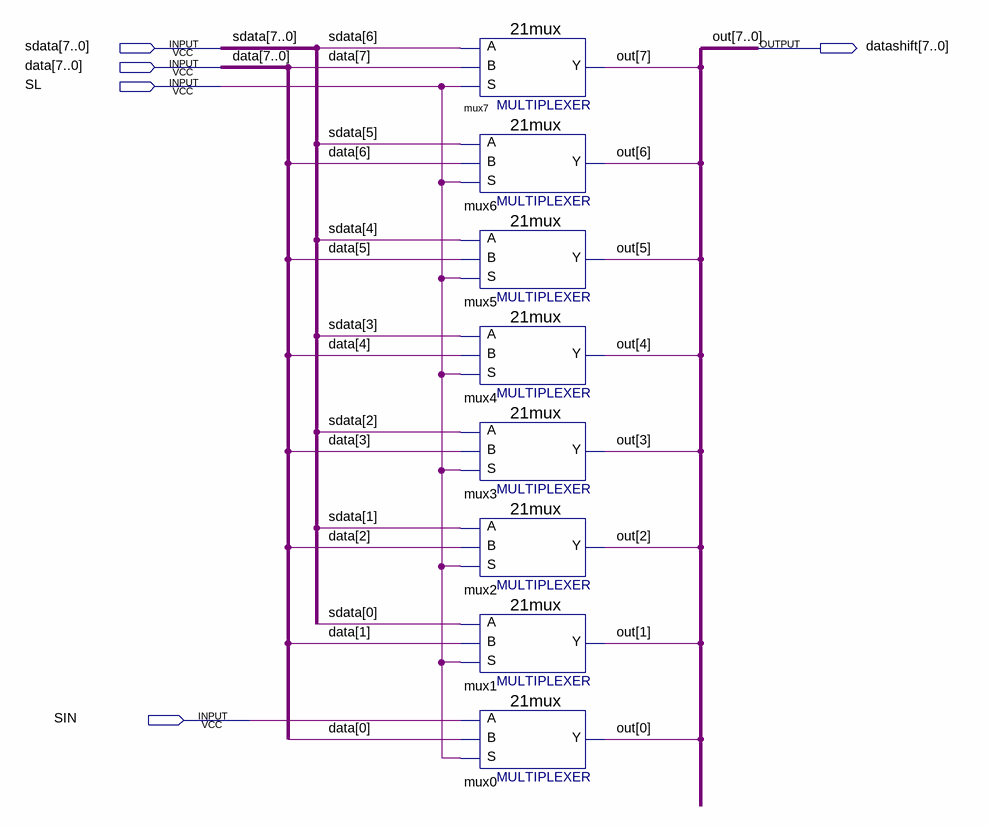
[diagram p0: schematic sheet]
// Quartus schematic LoaderShifter.bdf as structural Verilog: 8 symbols, 5 pins
module LoaderShifter (
  input  [7:0] sdata,
  input  [7:0] data,
  input  SL,
  input  SIN,
  output [7:0] datashift
);

  \21mux  mux7 (.S(SL), .B(data[7]), .A(sdata[6]), .Y(datashift[7]));
  \21mux  mux6 (.S(SL), .B(data[6]), .A(sdata[5]), .Y(datashift[6]));
  \21mux  mux5 (.S(SL), .B(data[5]), .A(sdata[4]), .Y(datashift[5]));
  \21mux  mux4 (.S(SL), .B(data[4]), .A(sdata[3]), .Y(datashift[4]));
  \21mux  mux3 (.S(SL), .B(data[3]), .A(sdata[2]), .Y(datashift[3]));
  \21mux  mux2 (.S(SL), .B(data[2]), .A(sdata[1]), .Y(datashift[2]));
  \21mux  mux1 (.S(SL), .B(data[1]), .A(sdata[0]), .Y(datashift[1]));
  \21mux  mux0 (.S(SL), .B(data[0]), .A(SIN), .Y(datashift[0]));

  // Other names for the same wires on the sheet: out[7:0] = datashift
endmodule
